# EasyEDA schematic Nakuja esp_lora_gps_sd.json
TITLE: Sheet_1; REV: 1.0; Date: 2022-04-21; Sheet: 1/1; Drawn By: Rodney Osodo; Company: Your Company
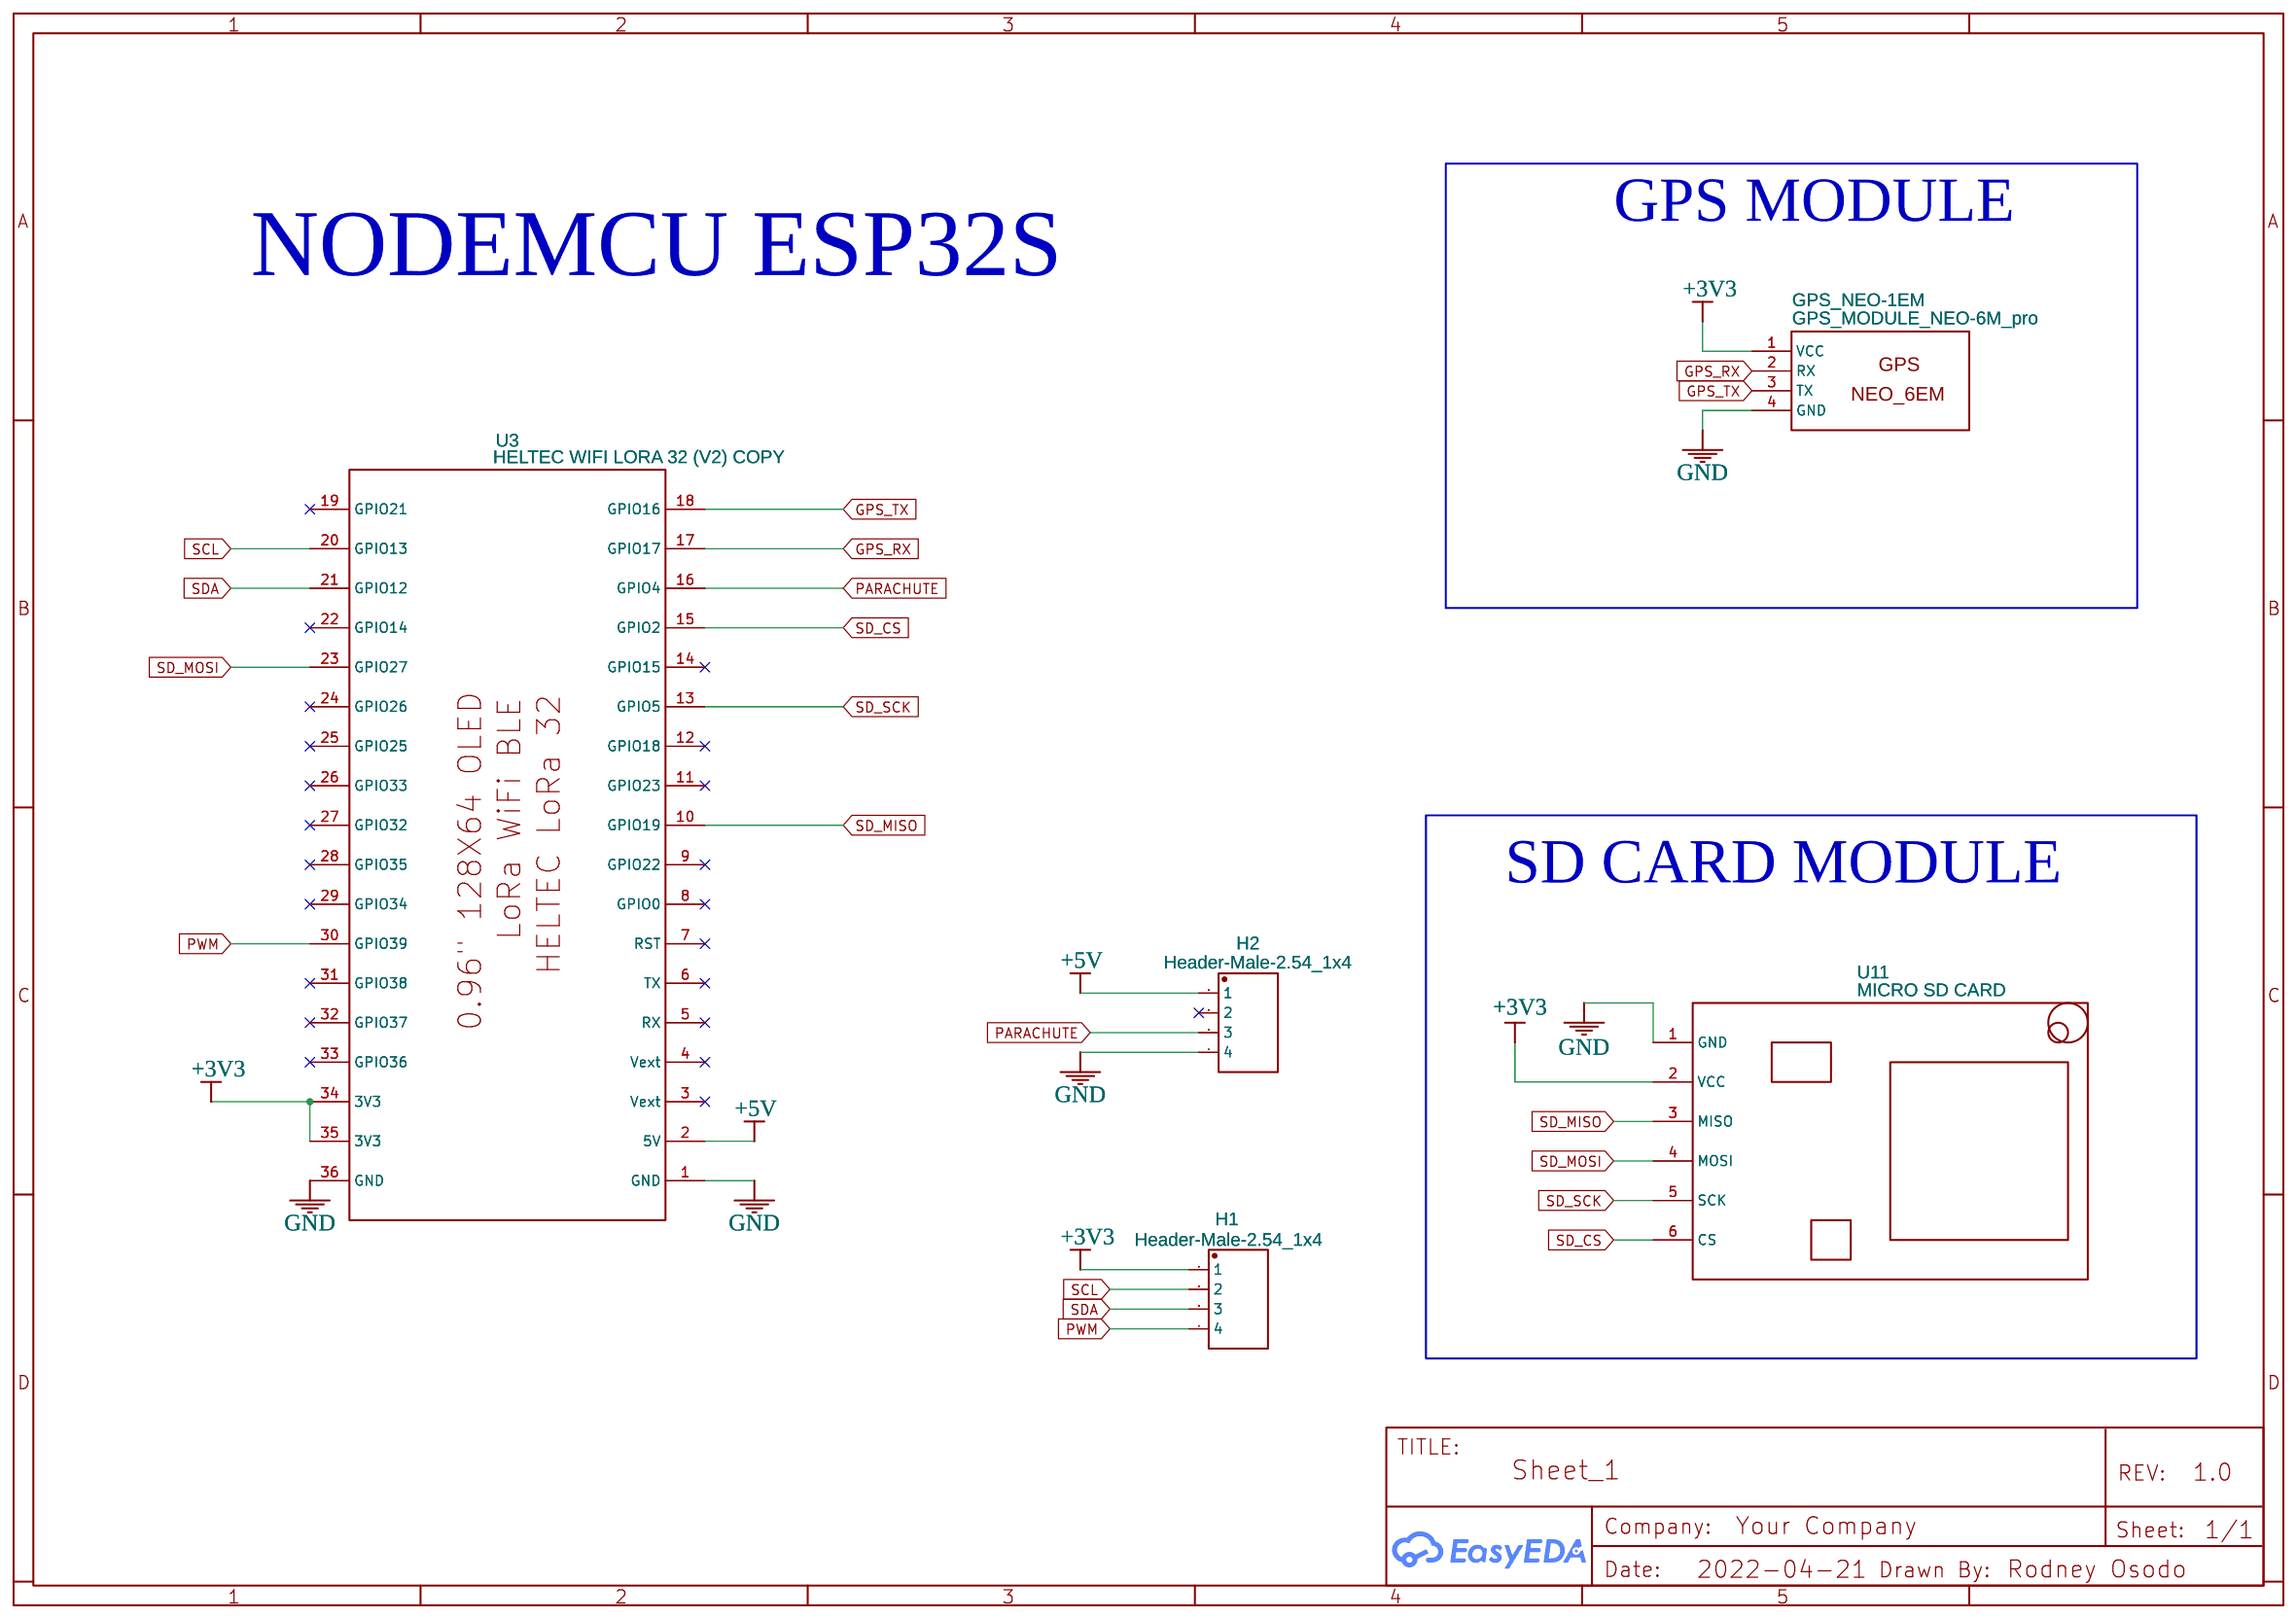
[diagram p0: schematic sheet]

## Parts
GPS_NEO-1EM  GPS_MODULE_NEO-6M_pro  [GPS_MODULE]
H1  Header-Male-2.54_1x4  [HDR-TH_4P-P2.54-V-M-1]
H2  Header-Male-2.54_1x4  [HDR-TH_4P-P2.54-V-M-1]
U3  HELTEC WIFI LORA 32 (V2) COPY  [HELTEC-LORA32-WIFI-BLE-OLED]
U11  MICRO SD CARD  [MICRO SD CARD]

## Library data of the parts
GPS_NEO-1EM = GPS_MODULE_NEO-6M_pro: Contributor: Sanchezz2; sourceId: cy4mEWdvN
H1 H2 = Header-Male-2.54_1x4: Supplier: LCSC; Manufacturer: Ckmtw; Manufacturer Part: 210S-1*4P L=11.6MMGold-plated black; Contributor: LCSC; Supplier Part: C124378; JLCPCB Part Class: Extended Part
U3 = HELTEC WIFI LORA 32 (V2) COPY: Manufacturer: Heltec; Manufacturer Part: Heltec WiFi LoRa 32(V2); Supplier: Heltec; Supplier Part: Heltec WiFi LoRa 32(V2); link: https://heltec.org/project/wifi-lora-32/; Contributor: mariozw
U11 = MICRO SD CARD: Supplier: RS-Online; Contributor: SRY TIS

## Nets
+3V3: GPS_NEO-1EM.1(VCC) H1.1 U3.34(3V3) U3.35(3V3) U11.2(VCC)
+5V: H2.1 U3.2(5V)
GND: GPS_NEO-1EM.4(GND) H2.4 U3.1(GND) U3.36(GND) U11.1(GND)
GPS_RX: GPS_NEO-1EM.2(RX) U3.17(GPIO17)
GPS_TX: GPS_NEO-1EM.3(TX) U3.18(GPIO16)
PARACHUTE: H2.3 U3.16(GPIO4)
PWM: H1.4 U3.30(GPIO39)
SCL: H1.2 U3.20(GPIO13)
SD_CS: U3.15(GPIO2) U11.6(CS)
SD_MISO: U3.10(GPIO19) U11.3(MISO)
SD_MOSI: U3.23(GPIO27) U11.4(MOSI)
SD_SCK: U3.13(GPIO5) U11.5(SCK)
SDA: H1.3 U3.21(GPIO12)

Not connected (* = marked no-connect by the designer): H2 2*; U3 3(Vext)* 4(Vext)* 5(RX)* 6(TX)* 7(RST)* 8(GPIO0)* 9(GPIO22)* 11(GPIO23)* 12(GPIO18)* 14(GPIO15)* 19(GPIO21)* 22(GPIO14)* 24(GPIO26)* 25(GPIO25)* 26(GPIO33)* 27(GPIO32)* 28(GPIO35)* 29(GPIO34)* 31(GPIO38)* 32(GPIO37)* 33(GPIO36)*

## Notes on the sheet
- GPS MODULE
- NODEMCU ESP32S
- SD CARD MODULE
